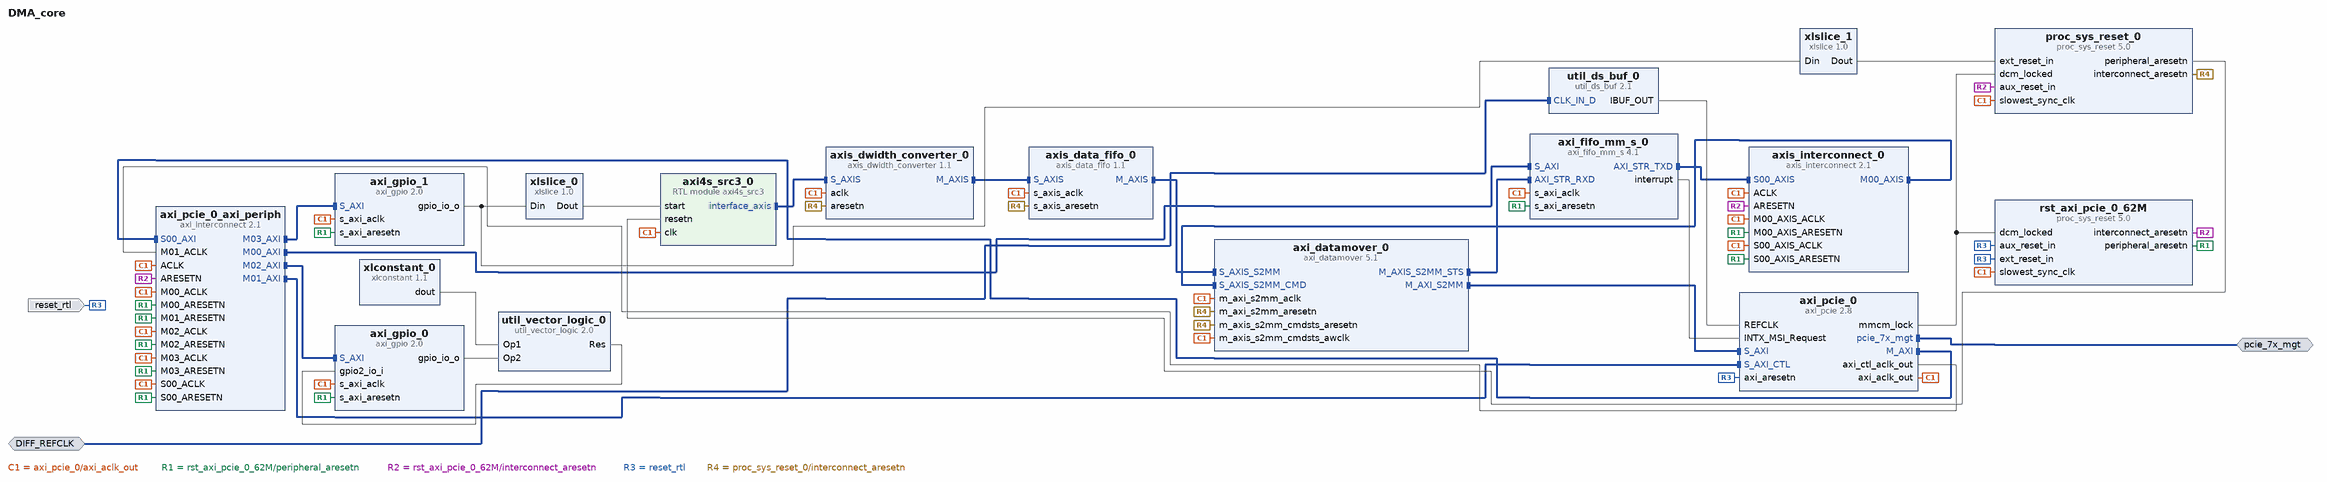
[diagram p0: block diagram of the top level]
# Vivado block design DMA_core, xc7a200tffv1156-2, Vivado 2016.4
create_bd_design DMA_core

create_bd_intf_port -mode Master -vlnv xilinx.com:interface:pcie_7x_mgt_rtl:1.0 pcie_7x_mgt
create_bd_intf_port -mode Slave -vlnv xilinx.com:interface:diff_clock_rtl:1.0 DIFF_REFCLK
set_property -dict {CONFIG.FREQ_HZ 100000000} [get_bd_intf_ports DIFF_REFCLK]
create_bd_port -dir I -type rst reset_rtl
set_property -dict {CONFIG.POLARITY ACTIVE_LOW} [get_bd_ports reset_rtl]

create_bd_cell -type ip -vlnv xilinx.com:ip:axi_datamover:5.1 axi_datamover_0
set_property -dict [list \
  CONFIG.c_include_s2mm Full \
  CONFIG.c_s2mm_btt_used 23 \
  CONFIG.c_s2mm_support_indet_btt true \
  CONFIG.c_enable_mm2s 0 \
] [get_bd_cells axi_datamover_0]
create_bd_cell -type ip -vlnv xilinx.com:ip:axi_fifo_mm_s:4.1 axi_fifo_mm_s_0
set_property -dict {CONFIG.C_USE_TX_CTRL 0} [get_bd_cells axi_fifo_mm_s_0]
create_bd_cell -type ip -vlnv xilinx.com:ip:axi_gpio:2.0 axi_gpio_0
set_property -dict [list \
  CONFIG.C_IS_DUAL 1 \
  CONFIG.C_ALL_INPUTS 0 \
  CONFIG.C_ALL_INPUTS_2 1 \
  CONFIG.C_ALL_OUTPUTS 1 \
] [get_bd_cells axi_gpio_0]
create_bd_cell -type ip -vlnv xilinx.com:ip:axi_gpio:2.0 axi_gpio_1
set_property -dict {CONFIG.C_GPIO_WIDTH 32 CONFIG.C_ALL_OUTPUTS 1} [get_bd_cells axi_gpio_1]
create_bd_cell -type ip -vlnv xilinx.com:ip:axi_pcie:2.8 axi_pcie_0
set_property -dict [list \
  CONFIG.NO_OF_LANES X4 \
  CONFIG.MAX_LINK_SPEED 2.5_GT/s \
  CONFIG.VENDOR_ID 0x32ab \
  CONFIG.DEVICE_ID 0x7014 \
  CONFIG.SUBSYSTEM_VENDOR_ID 0x32ab \
  CONFIG.BAR1_ENABLED true \
  CONFIG.BAR2_ENABLED true \
  CONFIG.BAR1_TYPE Memory \
  CONFIG.BAR2_TYPE Memory \
  CONFIG.BAR1_SCALE Kilobytes \
  CONFIG.BAR2_SCALE Kilobytes \
  CONFIG.BAR0_SIZE 16 \
  CONFIG.BAR1_SIZE 512 \
  CONFIG.BAR2_SIZE 16 \
  CONFIG.PCIEBAR2AXIBAR_0 0x00000000 \
  CONFIG.PCIEBAR2AXIBAR_1 0x40000000 \
  CONFIG.PCIEBAR2AXIBAR_2 0x44a00000 \
  CONFIG.AXIBAR_AS_0 true \
  CONFIG.AXIBAR2PCIEBAR_0 0x40000000 \
  CONFIG.S_AXI_DATA_WIDTH 128 \
  CONFIG.M_AXI_DATA_WIDTH 128 \
  CONFIG.BAR_64BIT false \
  CONFIG.shared_logic_in_core true \
] [get_bd_cells axi_pcie_0]
create_bd_cell -type ip -vlnv xilinx.com:ip:axi_interconnect:2.1 axi_pcie_0_axi_periph
set_property -dict {CONFIG.NUM_SI 1 CONFIG.NUM_MI 4} [get_bd_cells axi_pcie_0_axi_periph]
create_bd_cell -type ip -vlnv xilinx.com:ip:axis_data_fifo:1.1 axis_data_fifo_0
set_property -dict {CONFIG.TDATA_NUM_BYTES 16} [get_bd_cells axis_data_fifo_0]
create_bd_cell -type ip -vlnv xilinx.com:ip:axis_dwidth_converter:1.1 axis_dwidth_converter_0
set_property -dict {CONFIG.S_TDATA_NUM_BYTES 32 CONFIG.M_TDATA_NUM_BYTES 16} [get_bd_cells axis_dwidth_converter_0]
create_bd_cell -type ip -vlnv xilinx.com:ip:axis_interconnect:2.1 axis_interconnect_0
set_property -dict {CONFIG.NUM_MI 1} [get_bd_cells axis_interconnect_0]
create_bd_cell -type ip -vlnv xilinx.com:ip:proc_sys_reset:5.0 rst_axi_pcie_0_62M
create_bd_cell -type ip -vlnv xilinx.com:ip:util_vector_logic:2.0 util_vector_logic_0
set_property -dict {CONFIG.C_SIZE 32 CONFIG.C_OPERATION xor} [get_bd_cells util_vector_logic_0]
create_bd_cell -type ip -vlnv xilinx.com:ip:xlconstant:1.1 xlconstant_0
set_property -dict {CONFIG.CONST_WIDTH 32 CONFIG.CONST_VAL 0x12345678} [get_bd_cells xlconstant_0]
create_bd_cell -type ip -vlnv xilinx.com:ip:util_ds_buf:2.1 util_ds_buf_0
set_property -dict {CONFIG.C_BUF_TYPE IBUFDSGTE} [get_bd_cells util_ds_buf_0]
create_bd_cell -type module -reference axi4s_src3 axi4s_src3_0
create_bd_cell -type ip -vlnv xilinx.com:ip:xlslice:1.0 xlslice_0
create_bd_cell -type ip -vlnv xilinx.com:ip:xlslice:1.0 xlslice_1
set_property -dict {CONFIG.DOUT_WIDTH 1 CONFIG.DIN_TO 1 CONFIG.DIN_FROM 1} [get_bd_cells xlslice_1]
create_bd_cell -type ip -vlnv xilinx.com:ip:proc_sys_reset:5.0 proc_sys_reset_0

# ---- connections ----

connect_bd_intf_net [get_bd_intf_pins axi_fifo_mm_s_0/AXI_STR_RXD] [get_bd_intf_pins axi_datamover_0/M_AXIS_S2MM_STS]
connect_bd_intf_net [get_bd_intf_pins axi_datamover_0/M_AXI_S2MM] [get_bd_intf_pins axi_pcie_0/S_AXI]
connect_bd_intf_net [get_bd_intf_pins axi_pcie_0/M_AXI] [get_bd_intf_pins axi_pcie_0_axi_periph/S00_AXI]
connect_bd_intf_net [get_bd_intf_pins axi_pcie_0_axi_periph/M00_AXI] [get_bd_intf_pins axi_fifo_mm_s_0/S_AXI]
connect_bd_intf_net [get_bd_intf_pins axi_pcie_0_axi_periph/M01_AXI] [get_bd_intf_pins axi_pcie_0/S_AXI_CTL]
connect_bd_intf_net [get_bd_intf_pins axis_dwidth_converter_0/M_AXIS] [get_bd_intf_pins axis_data_fifo_0/S_AXIS]
connect_bd_intf_net [get_bd_intf_pins axi_datamover_0/S_AXIS_S2MM] [get_bd_intf_pins axis_data_fifo_0/M_AXIS]
connect_bd_intf_net [get_bd_intf_pins axi_pcie_0_axi_periph/M02_AXI] [get_bd_intf_pins axi_gpio_0/S_AXI]
connect_bd_intf_net [get_bd_intf_pins axi4s_src3_0/interface_axis] [get_bd_intf_pins axis_dwidth_converter_0/S_AXIS]
connect_bd_intf_net [get_bd_intf_pins axi_pcie_0_axi_periph/M03_AXI] [get_bd_intf_pins axi_gpio_1/S_AXI]
connect_bd_intf_net [get_bd_intf_pins axis_interconnect_0/M00_AXIS] [get_bd_intf_pins axi_datamover_0/S_AXIS_S2MM_CMD]
connect_bd_intf_net [get_bd_intf_pins axis_interconnect_0/S00_AXIS] [get_bd_intf_pins axi_fifo_mm_s_0/AXI_STR_TXD]
connect_bd_intf_net [get_bd_intf_ports pcie_7x_mgt] [get_bd_intf_pins axi_pcie_0/pcie_7x_mgt]
connect_bd_intf_net [get_bd_intf_ports DIFF_REFCLK] [get_bd_intf_pins util_ds_buf_0/CLK_IN_D]
connect_bd_net [get_bd_pins axi_pcie_0/axi_aclk_out] \
  [get_bd_pins axi_datamover_0/m_axi_s2mm_aclk] [get_bd_pins axi_datamover_0/m_axis_s2mm_cmdsts_awclk] \
  [get_bd_pins axi_fifo_mm_s_0/s_axi_aclk] [get_bd_pins axi_gpio_0/s_axi_aclk] [get_bd_pins axi_gpio_1/s_axi_aclk] \
  [get_bd_pins axis_data_fifo_0/s_axis_aclk] [get_bd_pins axis_dwidth_converter_0/aclk] \
  [get_bd_pins rst_axi_pcie_0_62M/slowest_sync_clk] [get_bd_pins axi4s_src3_0/clk] [get_bd_pins axi_pcie_0_axi_periph/ACLK] \
  [get_bd_pins axi_pcie_0_axi_periph/S00_ACLK] [get_bd_pins axi_pcie_0_axi_periph/M00_ACLK] \
  [get_bd_pins axi_pcie_0_axi_periph/M02_ACLK] [get_bd_pins axi_pcie_0_axi_periph/M03_ACLK] \
  [get_bd_pins axis_interconnect_0/ACLK] [get_bd_pins axis_interconnect_0/S00_AXIS_ACLK] \
  [get_bd_pins axis_interconnect_0/M00_AXIS_ACLK] [get_bd_pins proc_sys_reset_0/slowest_sync_clk]
connect_bd_net [get_bd_pins rst_axi_pcie_0_62M/peripheral_aresetn] \
  [get_bd_pins axi_fifo_mm_s_0/s_axi_aresetn] [get_bd_pins axi_gpio_0/s_axi_aresetn] [get_bd_pins axi_gpio_1/s_axi_aresetn] \
  [get_bd_pins axi_pcie_0_axi_periph/S00_ARESETN] [get_bd_pins axi_pcie_0_axi_periph/M00_ARESETN] \
  [get_bd_pins axi_pcie_0_axi_periph/M02_ARESETN] [get_bd_pins axi_pcie_0_axi_periph/M03_ARESETN] \
  [get_bd_pins axis_interconnect_0/S00_AXIS_ARESETN] [get_bd_pins axis_interconnect_0/M00_AXIS_ARESETN] \
  [get_bd_pins axi_pcie_0_axi_periph/M01_ARESETN]
connect_bd_net [get_bd_pins rst_axi_pcie_0_62M/interconnect_aresetn] \
  [get_bd_pins axi_pcie_0_axi_periph/ARESETN] [get_bd_pins axis_interconnect_0/ARESETN] \
  [get_bd_pins proc_sys_reset_0/aux_reset_in]
connect_bd_net [get_bd_pins axi_fifo_mm_s_0/interrupt] [get_bd_pins axi_pcie_0/INTX_MSI_Request]
connect_bd_net [get_bd_ports reset_rtl] \
  [get_bd_pins axi_pcie_0/axi_aresetn] [get_bd_pins rst_axi_pcie_0_62M/ext_reset_in] \
  [get_bd_pins rst_axi_pcie_0_62M/aux_reset_in]
connect_bd_net [get_bd_pins xlconstant_0/dout] [get_bd_pins util_vector_logic_0/Op1]
connect_bd_net [get_bd_pins axi_gpio_0/gpio_io_o] [get_bd_pins util_vector_logic_0/Op2]
connect_bd_net [get_bd_pins util_vector_logic_0/Res] [get_bd_pins axi_gpio_0/gpio2_io_i]
connect_bd_net [get_bd_pins util_ds_buf_0/IBUF_OUT] [get_bd_pins axi_pcie_0/REFCLK]
connect_bd_net [get_bd_pins axi_pcie_0/mmcm_lock] [get_bd_pins rst_axi_pcie_0_62M/dcm_locked] [get_bd_pins proc_sys_reset_0/dcm_locked]
connect_bd_net [get_bd_pins axi_pcie_0/axi_ctl_aclk_out] [get_bd_pins axi_pcie_0_axi_periph/M01_ACLK]
connect_bd_net [get_bd_pins proc_sys_reset_0/interconnect_aresetn] \
  [get_bd_pins axi_datamover_0/m_axis_s2mm_cmdsts_aresetn] [get_bd_pins axi_datamover_0/m_axi_s2mm_aresetn] \
  [get_bd_pins axis_data_fifo_0/s_axis_aresetn] [get_bd_pins axis_dwidth_converter_0/aresetn]
connect_bd_net [get_bd_pins axi_gpio_1/gpio_io_o] [get_bd_pins xlslice_1/Din] [get_bd_pins xlslice_0/Din]
connect_bd_net [get_bd_pins xlslice_0/Dout] [get_bd_pins axi4s_src3_0/start]
connect_bd_net [get_bd_pins xlslice_1/Dout] [get_bd_pins proc_sys_reset_0/ext_reset_in]
connect_bd_net [get_bd_pins proc_sys_reset_0/peripheral_aresetn] [get_bd_pins axi4s_src3_0/resetn]

# ---- address map ----
assign_bd_address -offset 0x00000000 -range 4G -target_address_space [get_bd_addr_spaces axi_datamover_0/Data_S2MM] [get_bd_addr_segs axi_pcie_0/S_AXI/BAR0]
assign_bd_address -offset 0x00000000 -range 256M -target_address_space [get_bd_addr_spaces axi_pcie_0/M_AXI] [get_bd_addr_segs axi_pcie_0/S_AXI_CTL/CTL0]
assign_bd_address -offset 0x40000000 -range 64K -target_address_space [get_bd_addr_spaces axi_pcie_0/M_AXI] [get_bd_addr_segs axi_gpio_0/S_AXI/Reg]
assign_bd_address -offset 0x40010000 -range 64K -target_address_space [get_bd_addr_spaces axi_pcie_0/M_AXI] [get_bd_addr_segs axi_gpio_1/S_AXI/Reg]
assign_bd_address -offset 0x44A00000 -range 64K -target_address_space [get_bd_addr_spaces axi_pcie_0/M_AXI] [get_bd_addr_segs axi_fifo_mm_s_0/S_AXI/Mem0]

validate_bd_design
save_bd_design
